# EasyEDA schematic schematic.json

## Sheets
1 Sheet_1: TITLE: Sheet_1; REV: 1.0; Date: 2025-08-02; Sheet: 1/1; Drawn By: fanyuxiang; Company: Your Company
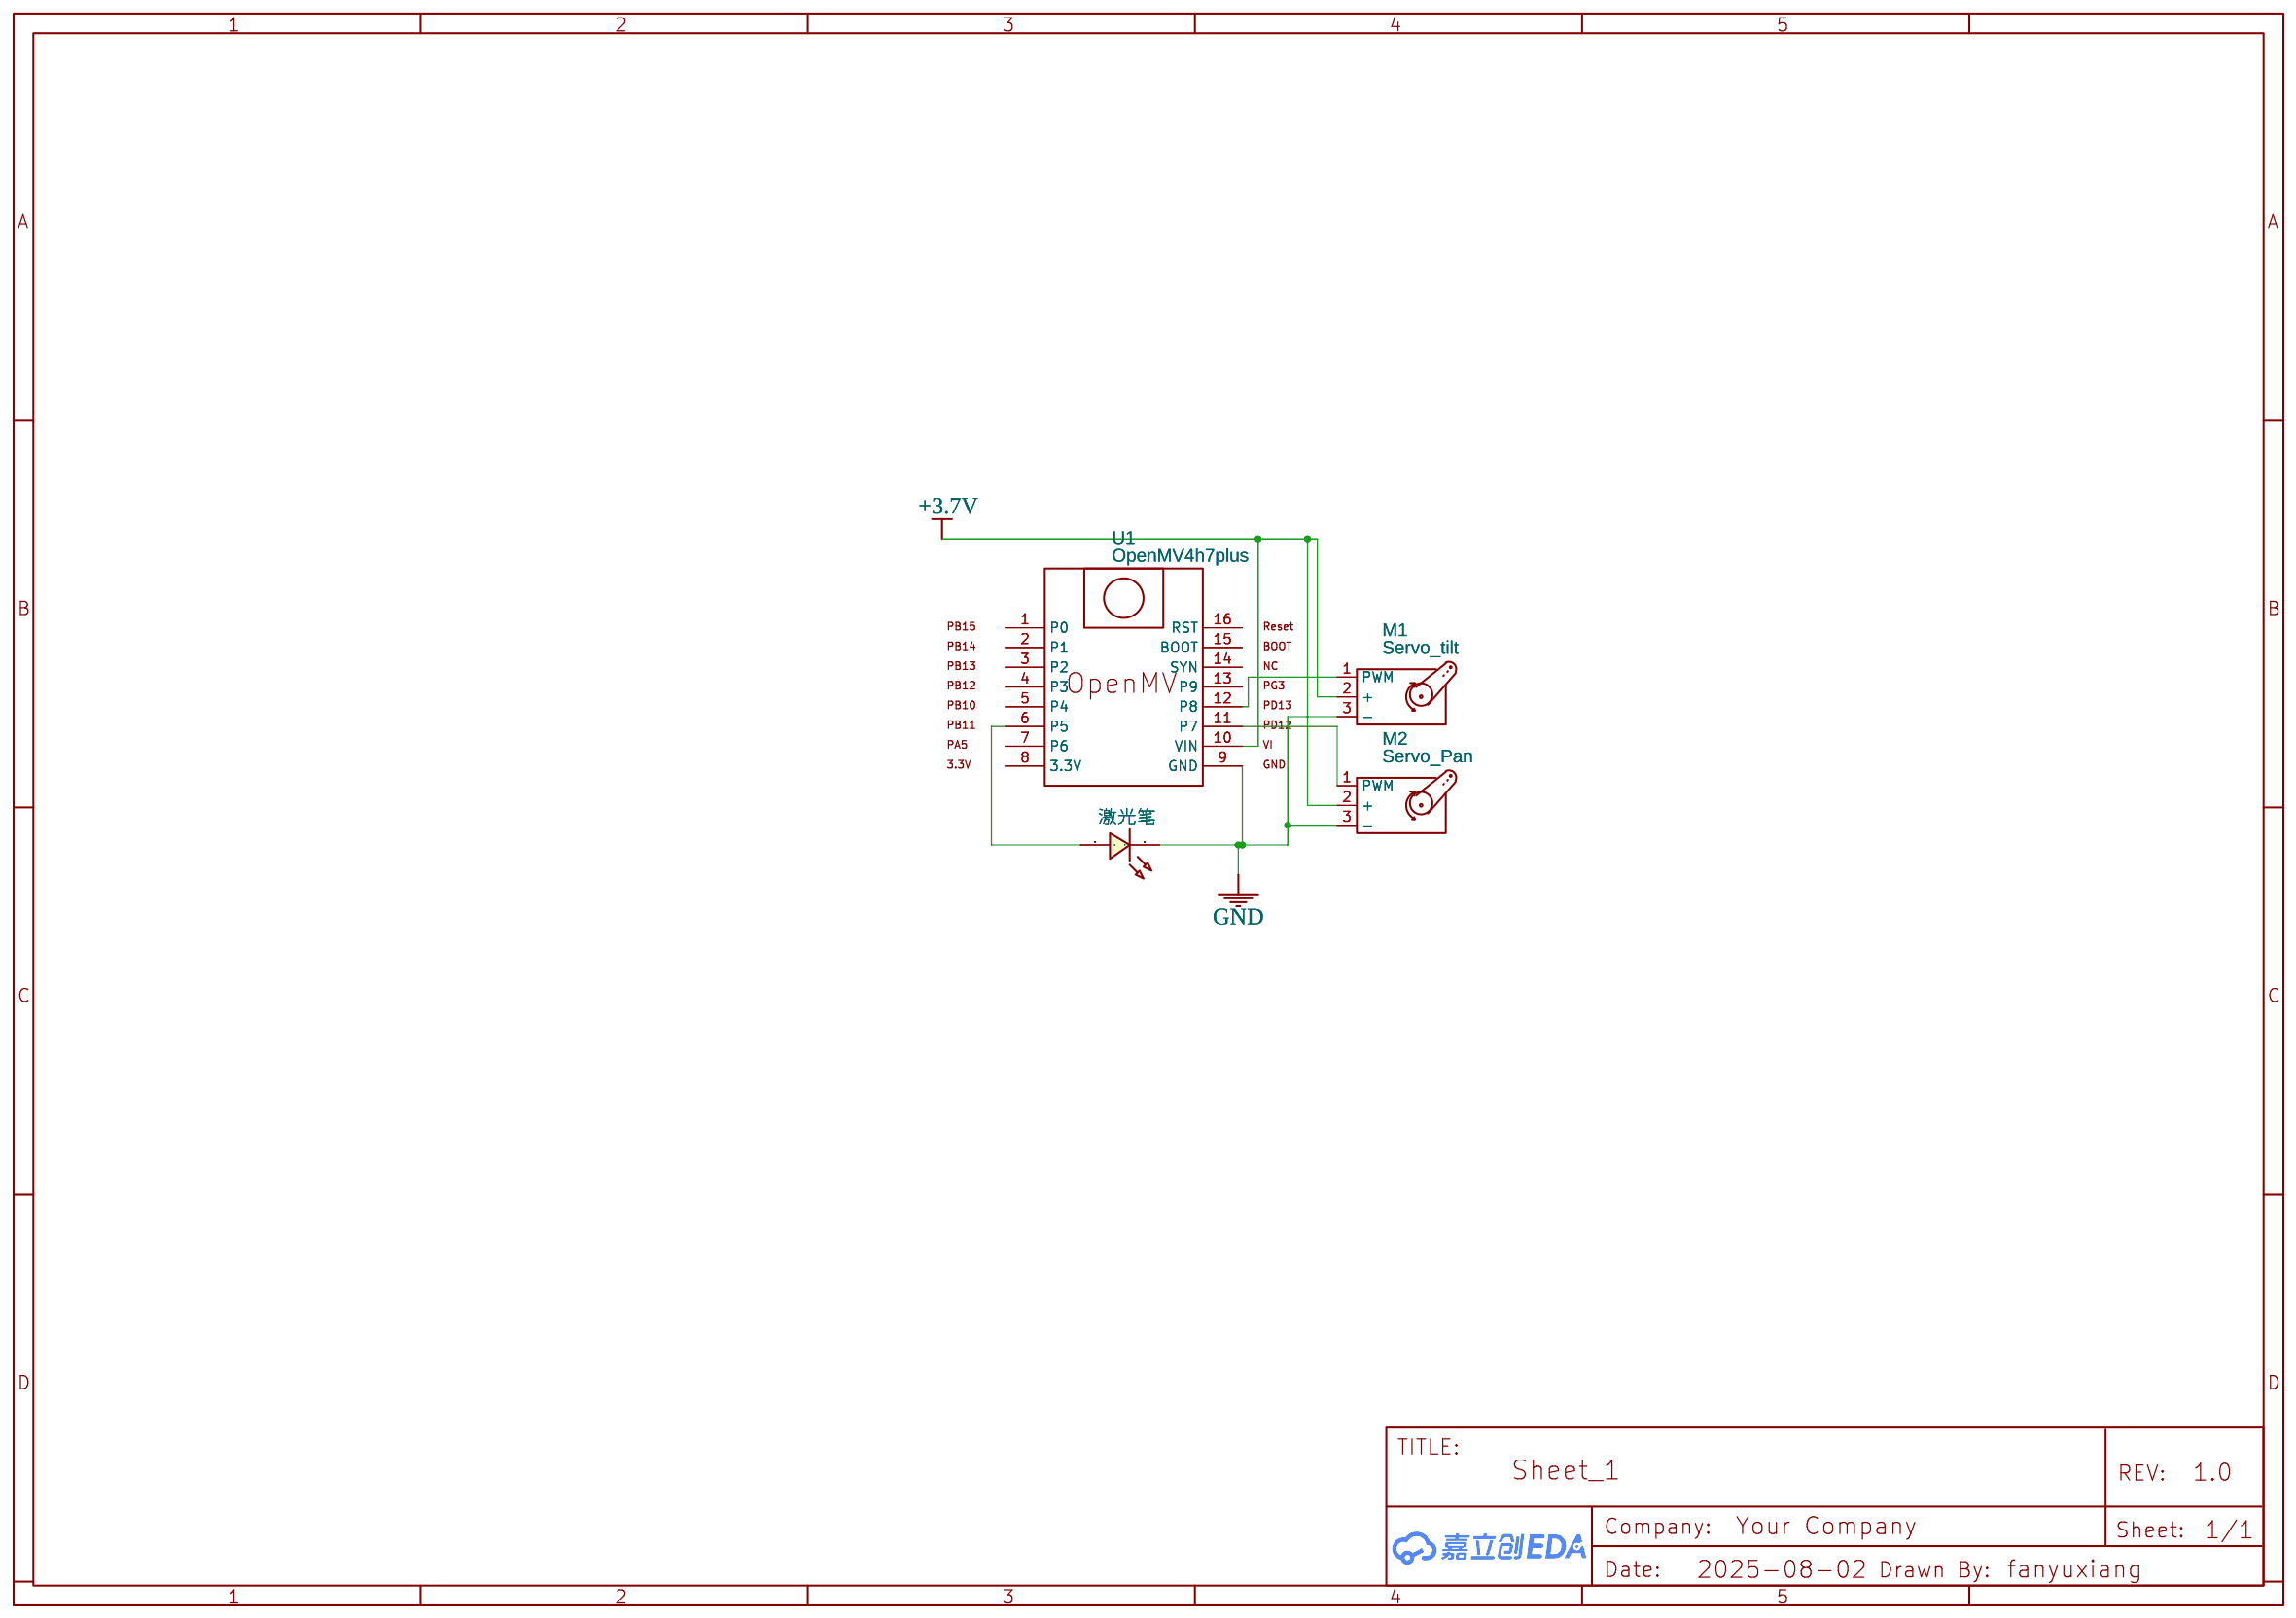
[diagram p0: Sheet_1]
2 Sheet_2: TITLE: Sheet_2; Date: 2025-08-09
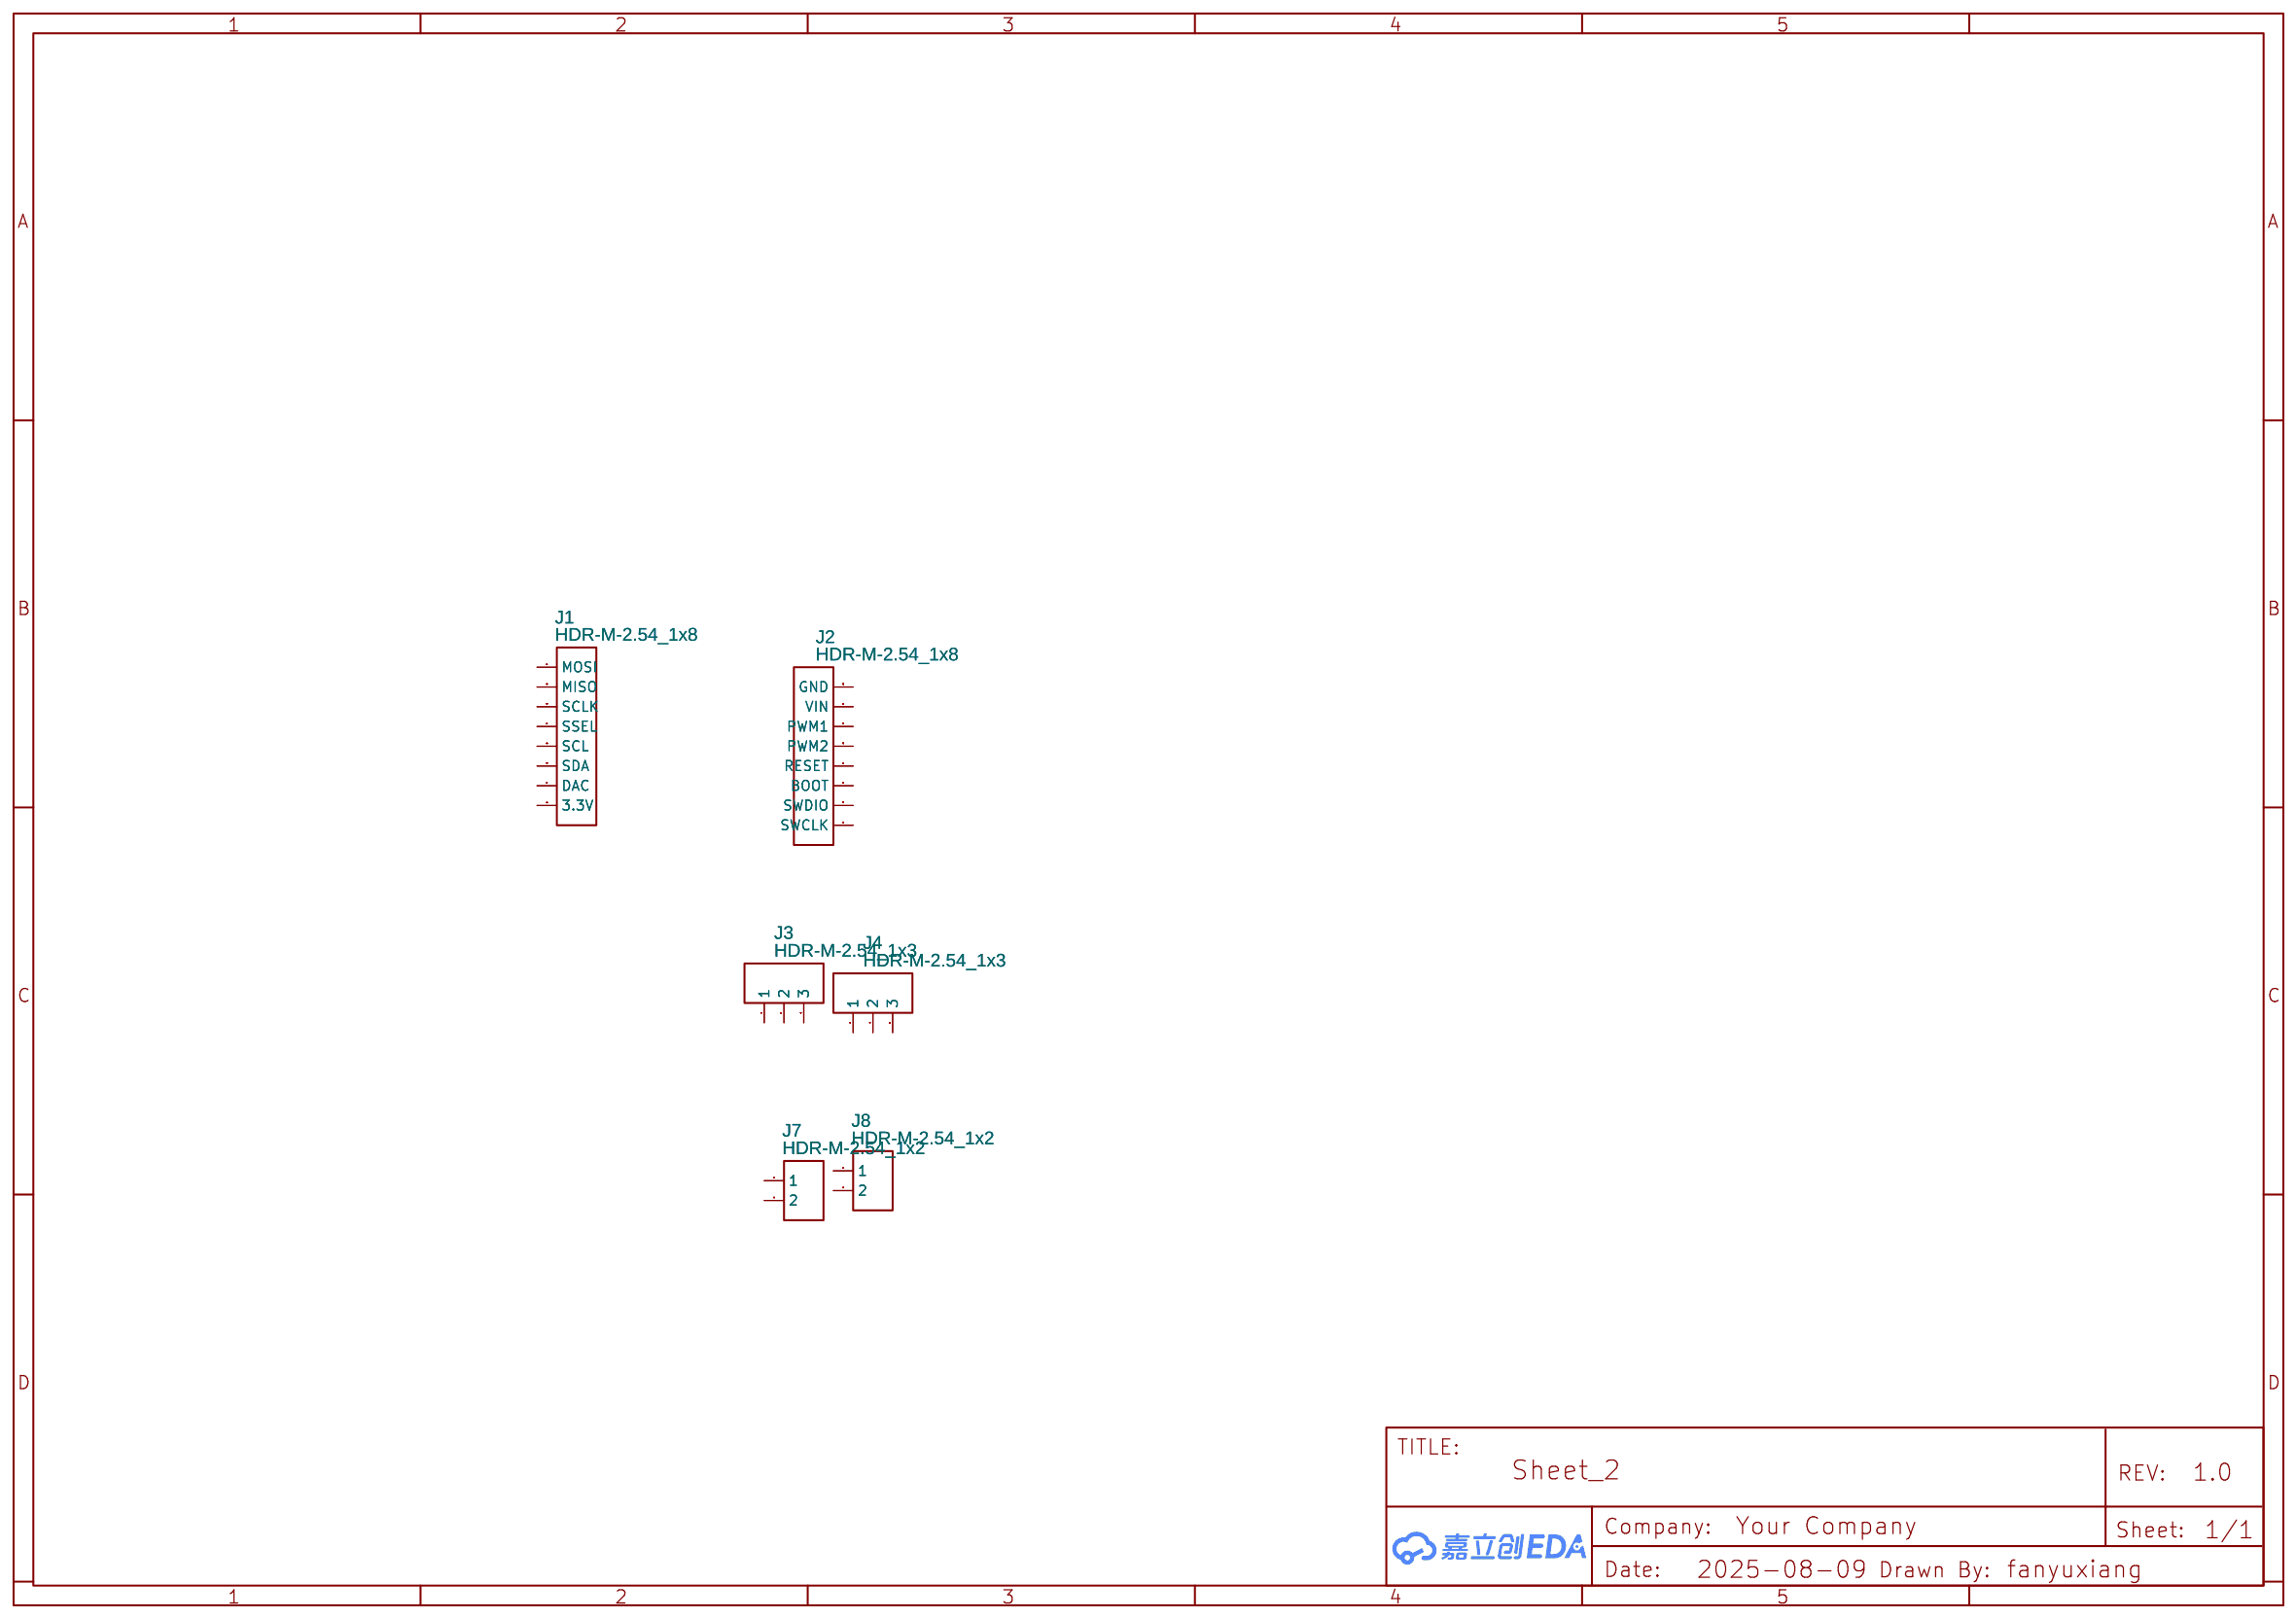
[diagram p1: Sheet_2]

## Parts
sheet Sheet_1
LASER  激光笔  [LED-TH_L10.5-W12.7-RD]
M1  Servo_tilt
M2  Servo_Pan
U1  OpenMV4h7plus  [OPENMV4]
sheet Sheet_2
J1  HDR-M-2.54_1x8  [HDR-M-2.54_1X8]
J2  HDR-M-2.54_1x8  [HDR-M-2.54_1X8]
J3  HDR-M-2.54_1x3  [HDR-M-2.54_1X3]
J4  HDR-M-2.54_1x3  [HDR-M-2.54_1X3]
J7  HDR-M-2.54_1x2  [HDR-M-2.54_1X2]
J8  HDR-M-2.54_1x2  [HDR-M-2.54_1X2]

## Library data of the parts
LASER = LASERDI SPL-PL90 A: Contributor: LCSC; Supplier: LCSC; Supplier Part: C538524; Manufacturer: Infineon(英飞凌)
M1 M2 = Motor_Servo: Contributor: KiCAD; license: https://www.gnu.org/licenses/lgpl-2.1.html
U1 = OpenMV4h7plus: Contributor: ayanami-ri
J1 J2 = HDR-M-2.54_1x8: Supplier Part: C190820; Supplier: LCSC; Contributor: LCEDA_Lib
J3 J4 = HDR-M-2.54_1x3: Supplier Part: C180248; Supplier: LCSC; Contributor: LCEDA_Lib
J7 J8 = HDR-M-2.54_1x2: Supplier Part: C124375; Supplier: LCSC; Contributor: LCEDA_Lib

## Nets
+3.7V: M1.2(+) M2.2(+) U1.10(VIN)
GND: LASER.1(-) M1.3(-) M2.3(-) U1.9(GND)
Net-(LASER-2): LASER.2(+) U1.6(P5)
Net-(M1-1): M1.1(PWM) U1.12(P8)
Net-(M2-1): M2.1(PWM) U1.11(P7)

Not connected (* = marked no-connect by the designer): J1 11(MOSI) 12(MISO) 13(SCLK) 14(SSEL) 15(SCL) 16(SDA) 17(DAC) 18(3.3V); J2 21(SWCLK) 22(SWDIO) 23(BOOT) 24(RESET) 25(PWM2) 26(PWM1) 27(VIN) 28(GND); J3 1 2 3; J4 1 2 3; J7 1 2; J8 1 2; U1 1(P0) 2(P1) 3(P2) 4(P3) 5(P4) 7(P6) 8(3.3V) 13(P9) 14(SYN) 15(BOOT) 16(RST)
